# EAGLE design Programmer connector (EAGLE 5.10)
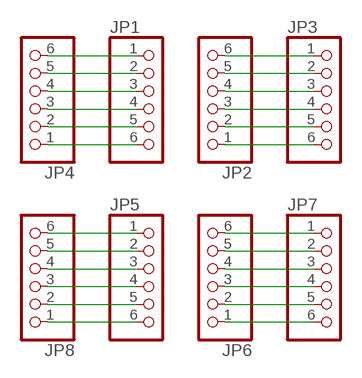
[diagram p0: schematic, sheet 1]

## Parts
JP1  PINHD-1X6  [1X06]
JP2  PINHD-1X6  [1X06]
JP3  PINHD-1X6  [1X06]
JP4  PINHD-1X6  [1X06]
JP5  PINHD-1X6  [1X06]
JP6  PINHD-1X6  [1X06]
JP7  PINHD-1X6  [1X06]
JP8  PINHD-1X6  [1X06]

## Nets
N$1: JP1.1 JP4.6
N$2: JP1.2 JP4.5
N$3: JP1.3 JP4.4
N$4: JP1.4 JP4.3
N$5: JP1.5 JP4.2
N$6: JP1.6 JP4.1
N$7: JP2.6 JP3.1
N$8: JP2.5 JP3.2
N$9: JP2.4 JP3.3
N$10: JP2.3 JP3.4
N$11: JP2.2 JP3.5
N$12: JP2.1 JP3.6
N$13: JP5.1 JP8.6
N$14: JP5.2 JP8.5
N$15: JP5.3 JP8.4
N$16: JP5.4 JP8.3
N$17: JP5.5 JP8.2
N$18: JP5.6 JP8.1
N$19: JP6.6 JP7.1
N$20: JP6.5 JP7.2
N$21: JP6.4 JP7.3
N$22: JP6.3 JP7.4
N$23: JP6.2 JP7.5
N$24: JP6.1 JP7.6

## Library data of the parts
JP1-JP8 = pinhead:PINHD-1X6: PIN HEADER

## Board
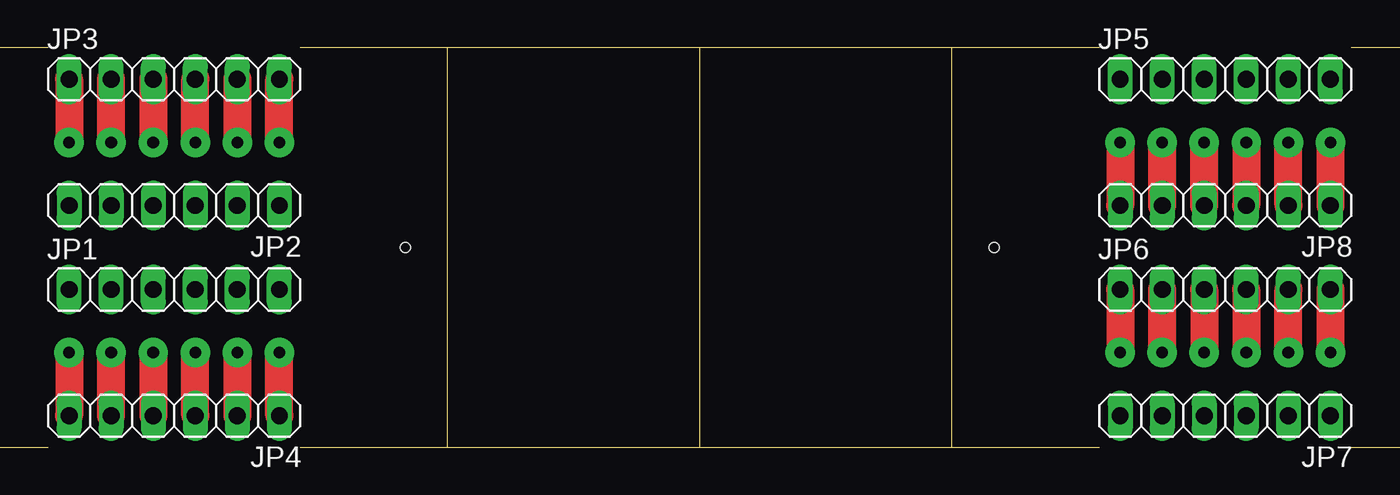
[diagram p1: board, top side]
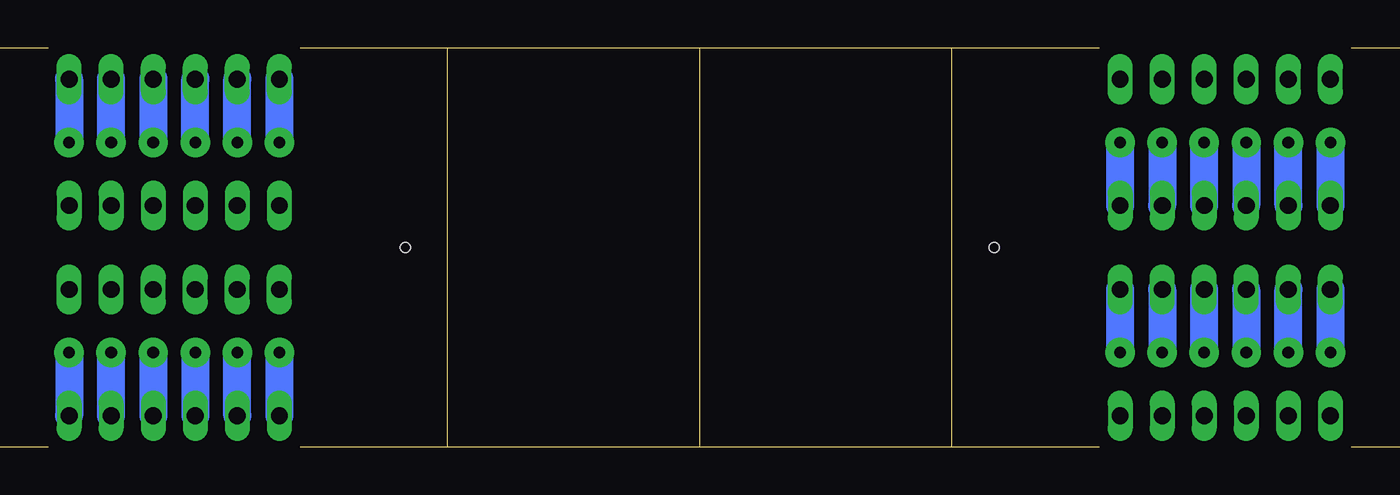
[diagram p2: board, bottom side, seen from below]

No outline drawn. Coordinates in mm, seen from the top.
Copper layers (1*16): Top 0.035mm / dielectric 1.5mm / Bottom 0.035mm
Design rules "default": minimum track width 10mil, minimum drill 24mil, track to track 8mil, track to pad 8mil, pad to pad 8mil, via to via 8mil, smd to smd 8mil, copper to edge 40mil, drill to drill 8mil, minimum pad ring 10mil, minimum via ring 8mil, stop-mask expansion 4mil, vias tented up to drill 0mil, thermal gap 10mil
Holes 0.6 mm at 1.27,13.97 29.21,13.97 64.77,13.97 92.71,13.97
Milling: 16 lines

### Footprints (pad centres in the part's own frame; a part is rotated, then mirrored left to right if it is on the bottom)
1X06 = drill 1.016 long: 1 -6.35,0; 2 -3.81,0; 3 -1.27,0; 4 1.27,0; 5 3.81,0; 6 6.35,0

### Placement (x,y rotation side)
JP1  15.24,11.43 0 top
JP2  15.24,16.51 180 top
JP3  15.24,24.13 0 top
JP4  15.24,3.81 180 top
JP5  78.74,24.13 0 top
JP6  78.74,11.43 0 top
JP7  78.74,3.81 180 top
JP8  78.74,16.51 180 top

### Tracks (layer width: path | path; a pad name or v marks a point on that pad's centre or on a via)
N$1  (via drill 0.7 pad 1.78)
  Top 1.676: v8.89,7.62 JP4.6
  Bottom 1.676: JP1.1 v8.89,7.62
N$2  (via drill 0.7 pad 1.78)
  Top 1.676: JP4.5 v11.43,7.62
  Bottom 1.676: v11.43,7.62 JP1.2
N$3  (via drill 0.7 pad 1.78)
  Top 1.676: v13.97,7.62 JP4.4
  Bottom 1.676: JP1.3 v13.97,7.62
N$4  (via drill 0.7 pad 1.78)
  Top 1.676: JP4.3 v16.51,7.62
  Bottom 1.676: v16.51,7.62 JP1.4
N$5  (via drill 0.7 pad 1.78)
  Top 1.676: v19.05,7.62 JP4.2
  Bottom 1.676: JP1.5 v19.05,7.62
N$6  (via drill 0.7 pad 1.78)
  Top 1.676: JP4.1 v21.59,7.62
  Bottom 1.676: v21.59,7.62 JP1.6
N$7  (via drill 0.7 pad 1.78)
  Top 1.676: JP3.1 v8.89,20.32
  Bottom 1.676: v8.89,20.32 JP2.6
N$8  (via drill 0.7 pad 1.78)
  Top 1.676: v11.43,20.32 JP3.2
  Bottom 1.676: JP2.5 v11.43,20.32
N$9  (via drill 0.7 pad 1.78)
  Top 1.676: JP3.3 v13.97,20.32
  Bottom 1.676: v13.97,20.32 JP2.4
N$10  (via drill 0.7 pad 1.78)
  Top 1.676: v16.51,20.32 JP3.4
  Bottom 1.676: JP2.3 v16.51,20.32
N$11  (via drill 0.7 pad 1.78)
  Top 1.676: JP3.5 v19.05,20.32
  Bottom 1.676: v19.05,20.32 JP2.2
N$12  (via drill 0.7 pad 1.78)
  Top 1.676: v21.59,20.32 JP3.6
  Bottom 1.676: JP2.1 v21.59,20.32
N$13  (via drill 0.7 pad 1.78)
  Top 1.676: v72.39,20.32 JP8.6
  Bottom 1.676: JP5.1 v72.39,20.32
N$14  (via drill 0.7 pad 1.78)
  Top 1.676: JP8.5 v74.93,20.32
  Bottom 1.676: v74.93,20.32 JP5.2
N$15  (via drill 0.7 pad 1.78)
  Top 1.676: JP8.4 v77.47,20.32
  Bottom 1.676: v77.47,20.32 JP5.3
N$16  (via drill 0.7 pad 1.78)
  Top 1.676: v80.01,20.32 JP8.3
  Bottom 1.676: JP5.4 v80.01,20.32
N$17  (via drill 0.7 pad 1.78)
  Top 1.676: JP8.2 v82.55,20.32
  Bottom 1.676: v82.55,20.32 JP5.5
N$18  (via drill 0.7 pad 1.78)
  Top 1.676: v85.09,20.32 JP8.1
  Bottom 1.676: JP5.6 v85.09,20.32
N$19  (via drill 0.7 pad 1.78)
  Top 1.676: JP6.6 v85.09,7.62
  Bottom 1.676: v85.09,7.62 JP7.1
N$20  (via drill 0.7 pad 1.78)
  Top 1.676: v82.55,7.62 JP6.5
  Bottom 1.676: JP7.2 v82.55,7.62
N$21  (via drill 0.7 pad 1.78)
  Top 1.676: JP6.4 v80.01,7.62
  Bottom 1.676: v80.01,7.62 JP7.3
N$22  (via drill 0.7 pad 1.78)
  Top 1.676: JP6.3 v77.47,7.62
  Bottom 1.676: v77.47,7.62 JP7.4
N$23  (via drill 0.7 pad 1.78)
  Top 1.676: v74.93,7.62 JP6.2
  Bottom 1.676: JP7.5 v74.93,7.62
N$24  (via drill 0.7 pad 1.78)
  Top 1.676: JP6.1 v72.39,7.62
  Bottom 1.676: v72.39,7.62 JP7.6